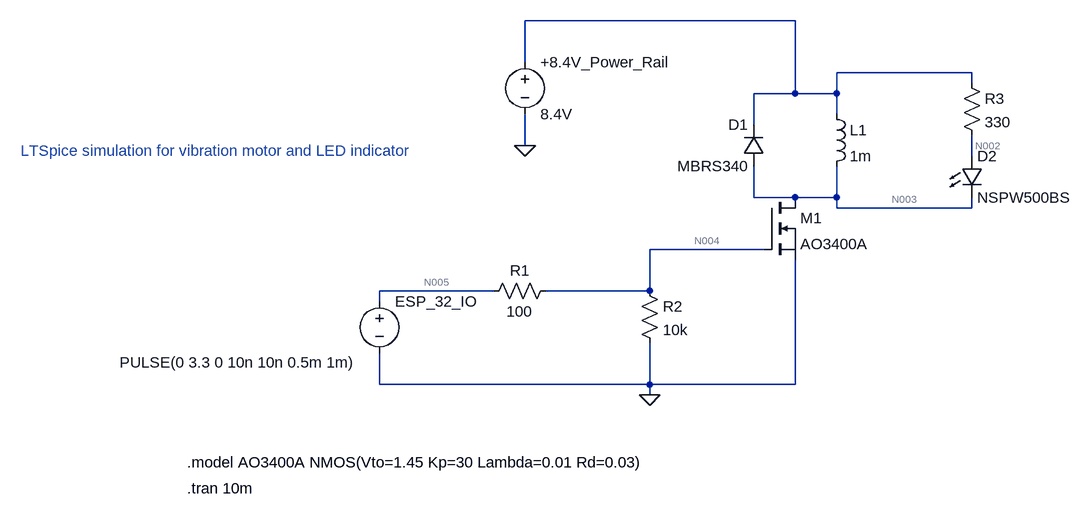
[diagram p0: schematic Schematic_v1.asc]
Schematic_v1.asc, the LTspice schematic file:
Version 4.1
SHEET 1 900 1088
WIRE 48 144 -368 144
WIRE -368 208 -368 144
WIRE 320 224 112 224
WIRE 320 240 320 224
WIRE 48 256 48 144
WIRE 48 256 -16 256
WIRE 112 256 112 224
WIRE 112 256 48 256
WIRE 112 288 112 256
WIRE -16 304 -16 256
WIRE -368 336 -368 288
WIRE 320 352 320 320
WIRE -16 416 -16 368
WIRE 48 416 -16 416
WIRE 112 416 112 368
WIRE 112 416 48 416
WIRE 112 432 112 416
WIRE 320 432 320 416
WIRE 320 432 112 432
WIRE 0 496 -176 496
WIRE -416 560 -592 560
WIRE -176 560 -176 496
WIRE -176 560 -336 560
WIRE -592 576 -592 560
WIRE -592 704 -592 656
WIRE -176 704 -176 640
WIRE -176 704 -592 704
WIRE 48 704 48 512
WIRE 48 704 -176 704
WIRE -176 720 -176 704
FLAG -368 336 0
FLAG -176 720 0
SYMBOL voltage -368 192 R0
WINDOW 123 0 0 Left 0
WINDOW 39 0 0 Left 0
SYMATTR InstName +8.4V_Power_Rail
SYMATTR Value 8.4V
SYMBOL nmos 0 416 R0
SYMATTR InstName M1
SYMATTR Value AO3400A
SYMBOL res -320 544 R90
WINDOW 0 0 56 VBottom 2
WINDOW 3 32 56 VTop 2
SYMATTR InstName R1
SYMATTR Value 100
SYMBOL res -192 544 R0
SYMATTR InstName R2
SYMATTR Value 10k
SYMBOL diode 0 368 R180
WINDOW 0 24 64 Left 2
WINDOW 3 24 0 Left 2
SYMATTR InstName D1
SYMATTR Value MBRS340
SYMBOL ind 96 272 R0
SYMATTR InstName L1
SYMATTR Value 1m
SYMATTR SpiceLine Rser=60
SYMBOL voltage -592 560 R0
WINDOW 3 -400 110 Left 2
WINDOW 123 0 0 Left 0
WINDOW 39 0 0 Left 0
SYMATTR Value PULSE(0 3.3 0 10n 10n 0.5m 1m)
SYMATTR InstName ESP_32_IO
SYMBOL res 304 224 R0
SYMATTR InstName R3
SYMATTR Value 330
SYMATTR SpiceLine tol=5
SYMBOL LED 304 352 R0
SYMATTR InstName D2
SYMATTR Value NSPW500BS
TEXT -888 824 Left 2 !.model AO3400A NMOS(Vto=1.45 Kp=30 Lambda=0.01 Rd=0.03)
TEXT -888 864 Left 2 !.tran 10m
TEXT -1144 344 Left 2 ;LTSpice simulation for vibration motor and LED indicator

The netlist it stands for:
* Schematic_v1.asc
V§+8.4V_Power_Rail N001 0 8.4V
M1 N003 N004 0 0 AO3400A
R1 N004 N005 100
R2 N004 0 10k
D1 N003 N001 MBRS340
L1 N001 N003 1m Rser=60
V§ESP_32_IO N005 0 PULSE(0 3.3 0 10n 10n 0.5m 1m)
R3 N001 N002 330 tol=5
D2 N002 N003 NSPW500BS
.model D D
.lib standard.dio
.model NMOS NMOS
.model PMOS PMOS
.lib standard.mos
.model AO3400A NMOS(Vto=1.45 Kp=30 Lambda=0.01 Rd=0.03)
.tran 10m
* LTSpice simulation for vibration motor and LED indicator
.backanno
.end

* Results of the author's LTspice run, read from the files saved beside the schematic
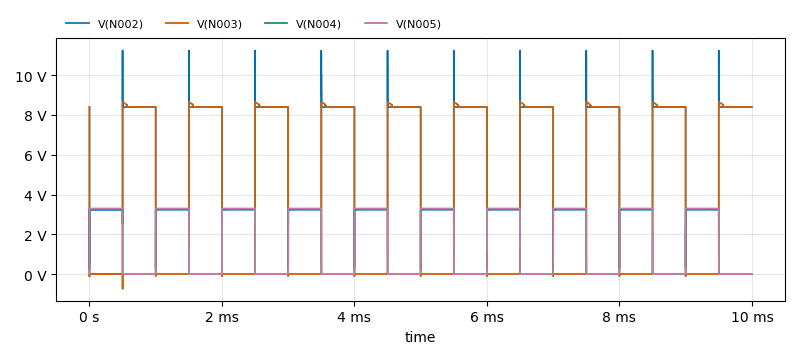
[diagram p1: Transient Analysis of Schematic_v1.asc, plotted from the saved traces]
* Transient Analysis, 1 run:
*   V(N002): min 255.7 mV, max 11.25 V, average 5.818 V, rms 6.365 V, last 8.4 V
*   V(N003): min -737 mV, max 8.657 V, average 4.216 V, rms 5.957 V, last 8.4 V
*   V(N004): min 0 V, max 3.267 V, average 1.634 V, rms 2.31 V, last 0 V
*   V(N005): min 0 V, max 3.3 V, average 1.65 V, rms 2.333 V, last 0 V